# EAGLE schematic MAAV_Vehicle_13v1 (EAGLE 5.11)
DIGIKEY: SI4114DY-T1-GE3CT-ND; DIGIKEY_ASSOC: P5.1MGCT-ND

## Sheet 1 of 7
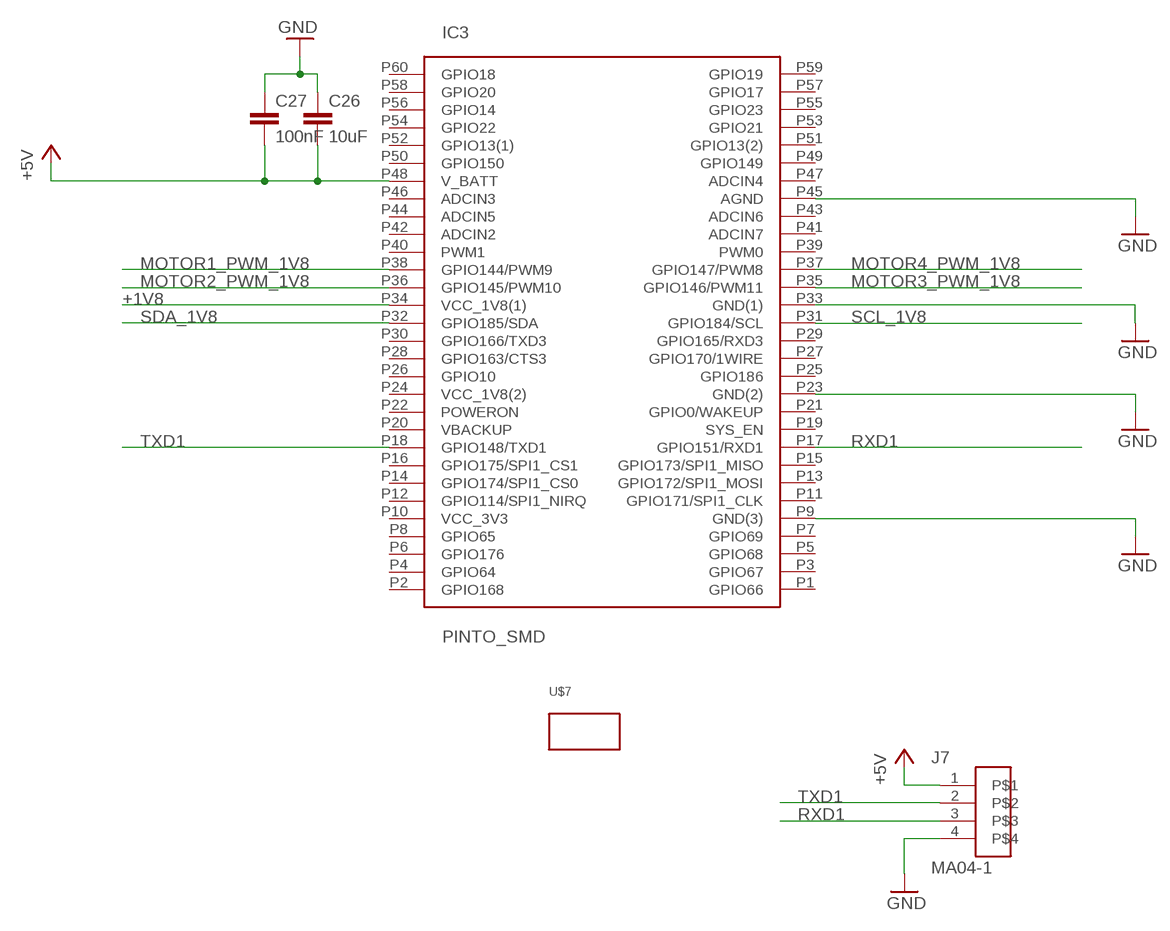
[diagram p0: schematic, sheet 1]

### Parts
C26  10uF  CAP0603-CAP  [0603-CAP]
C27  100nF  CAP0603-CAP  [0603-CAP]
IC3  PINTO_SMD  [PINTO_SMD]
J7  MA04-1  [455-1751-1-ND]
U$7  IMU  [IMU]

### Nets
+1V8: IC3.P34(VCC_1V8(1)) ; also sheet 2
+5V: C26.2 C27.2 IC3.P48(V_BATT) J7.1 ; also sheet 2,3,4,6,7
GND: C26.1 C27.1 IC3.P9(GND(3)) IC3.P23(GND(2)) IC3.P33(GND(1)) IC3.P45(AGND) J7.4 ; also sheet 3,4,5,6,7
MOTOR1_PWM_1V8: IC3.P38(GPIO144/PWM9) ; also sheet 2
MOTOR2_PWM_1V8: IC3.P36(GPIO145/PWM10) ; also sheet 2
MOTOR3_PWM_1V8: IC3.P35(GPIO146/PWM11) ; also sheet 2
MOTOR4_PWM_1V8: IC3.P37(GPIO147/PWM8) ; also sheet 2
RXD1: IC3.P17(GPIO151/RXD1) J7.3
SCL_1V8: IC3.P31(GPIO184/SCL) ; also sheet 2
SDA_1V8: IC3.P32(GPIO185/SDA) ; also sheet 2
TXD1: IC3.P18(GPIO148/TXD1) J7.2
Unconnected: IC3.P1(GPIO66) IC3.P2(GPIO168) IC3.P3(GPIO67) IC3.P4(GPIO64) IC3.P5(GPIO68) IC3.P6(GPIO176) IC3.P7(GPIO69) IC3.P8(GPIO65) IC3.P10(VCC_3V3) IC3.P11(GPIO171/SPI1_CLK) IC3.P12(GPIO114/SPI1_NIRQ) IC3.P13(GPIO172/SPI1_MOSI) IC3.P14(GPIO174/SPI1_CS0) IC3.P15(GPIO173/SPI1_MISO) IC3.P16(GPIO175/SPI1_CS1) IC3.P19(SYS_EN) IC3.P20(VBACKUP) IC3.P21(GPIO0/WAKEUP) IC3.P22(POWERON) IC3.P24(VCC_1V8(2)) IC3.P25(GPIO186) IC3.P26(GPIO10) IC3.P27(GPIO170/1WIRE) IC3.P28(GPIO163/CTS3) IC3.P29(GPIO165/RXD3) IC3.P30(GPIO166/TXD3) IC3.P39(PWM0) IC3.P40(PWM1) IC3.P41(ADCIN7) IC3.P42(ADCIN2) IC3.P43(ADCIN6) IC3.P44(ADCIN5) IC3.P46(ADCIN3) IC3.P47(ADCIN4) IC3.P49(GPIO149) IC3.P50(GPIO150) IC3.P51(GPIO13(2)) IC3.P52(GPIO13(1)) IC3.P53(GPIO21) IC3.P54(GPIO22) IC3.P55(GPIO23) IC3.P56(GPIO14) IC3.P57(GPIO17) IC3.P58(GPIO20) IC3.P59(GPIO19) IC3.P60(GPIO18)

## Sheet 2 of 7
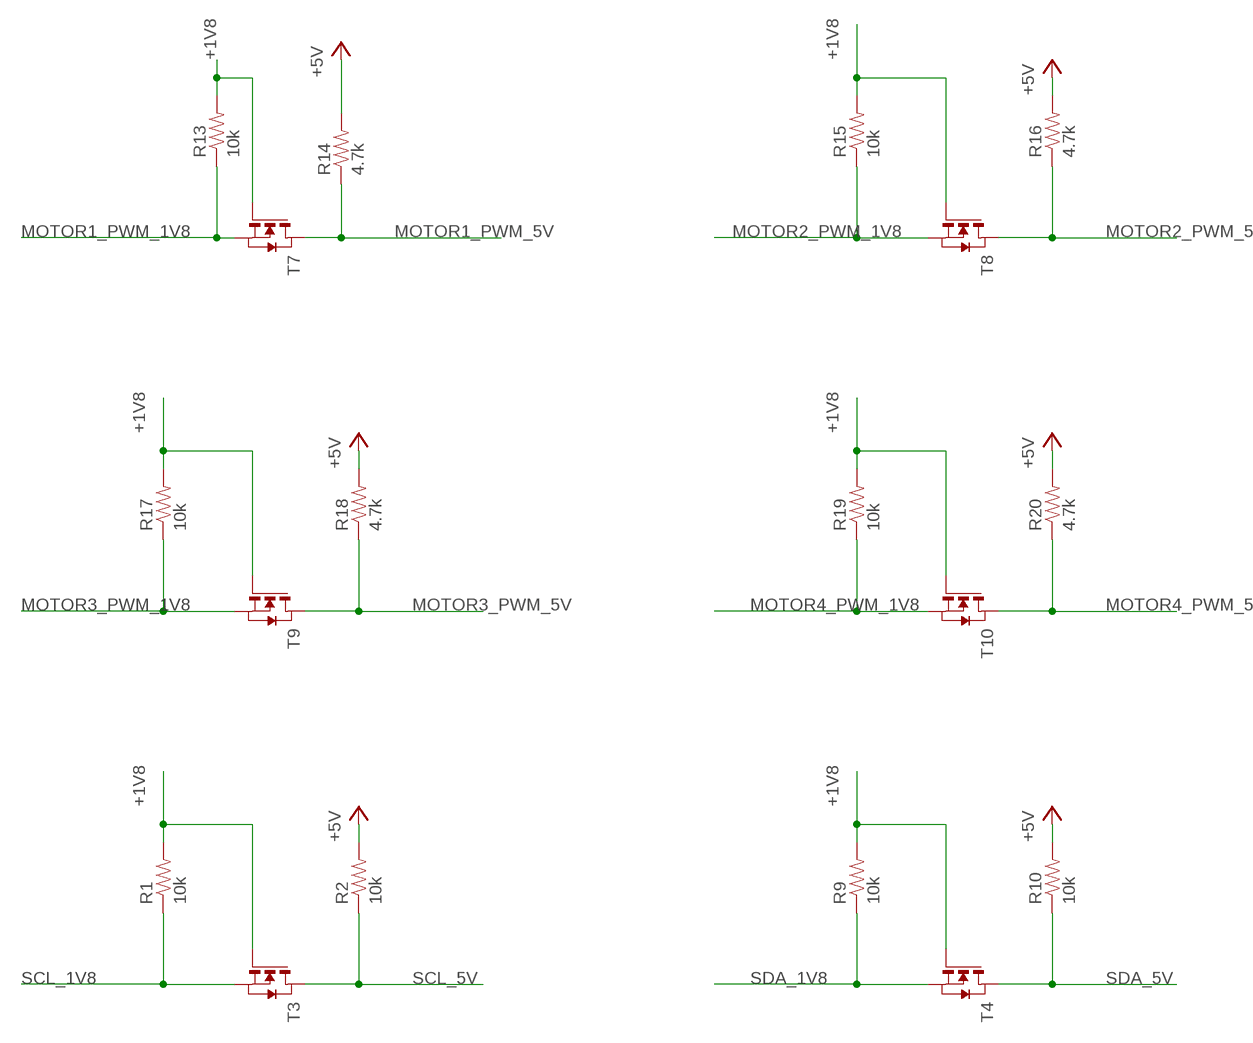
[diagram p1: schematic, sheet 2]

### Parts
R1  10k  RESISTOR0603-RES  [0603-RES]
R2  10k  RESISTOR0603-RES  [0603-RES]
R9  10k  RESISTOR0603-RES  [0603-RES]
R10  10k  RESISTOR0603-RES  [0603-RES]
R13  10k  RESISTOR0603-RES  [0603-RES]
R14  4.7k  RESISTOR0603-RES  [0603-RES]
R15  10k  RESISTOR0603-RES  [0603-RES]
R16  4.7k  RESISTOR0603-RES  [0603-RES]
R17  10k  RESISTOR0603-RES  [0603-RES]
R18  4.7k  RESISTOR0603-RES  [0603-RES]
R19  10k  RESISTOR0603-RES  [0603-RES]
R20  4.7k  RESISTOR0603-RES  [0603-RES]
T3  NMOSSOT23  [SOT-23]
T4  NMOSSOT23  [SOT-23]
T7  NMOSSOT23  [SOT-23]
T8  NMOSSOT23  [SOT-23]
T9  NMOSSOT23  [SOT-23]
T10  NMOSSOT23  [SOT-23]

### Nets
+1V8: R1.2 R9.2 R13.2 R15.2 R17.2 R19.2 T3.3(G) T4.3(G) T7.3(G) T8.3(G) T9.3(G) T10.3(G) ; also sheet 1
+5V: R2.2 R10.2 R14.2 R16.2 R18.2 R20.2 ; also sheet 1,3,4,6,7
MOTOR1_PWM_1V8: R13.1 T7.2(S) ; also sheet 1
MOTOR1_PWM_5V: R14.1 T7.1(D) ; also sheet 5
MOTOR2_PWM_1V8: R15.1 T8.2(S) ; also sheet 1
MOTOR2_PWM_5V: R16.1 T8.1(D) ; also sheet 5
MOTOR3_PWM_1V8: R17.1 T9.2(S) ; also sheet 1
MOTOR3_PWM_5V: R18.1 T9.1(D) ; also sheet 5
MOTOR4_PWM_1V8: R19.1 T10.2(S) ; also sheet 1
MOTOR4_PWM_5V: R20.1 T10.1(D) ; also sheet 5
SCL_1V8: R1.1 T3.2(S) ; also sheet 1
SCL_5V: R2.1 T3.1(D) ; also sheet 3
SDA_1V8: R9.1 T4.2(S) ; also sheet 1
SDA_5V: R10.1 T4.1(D) ; also sheet 3

## Sheet 3 of 7
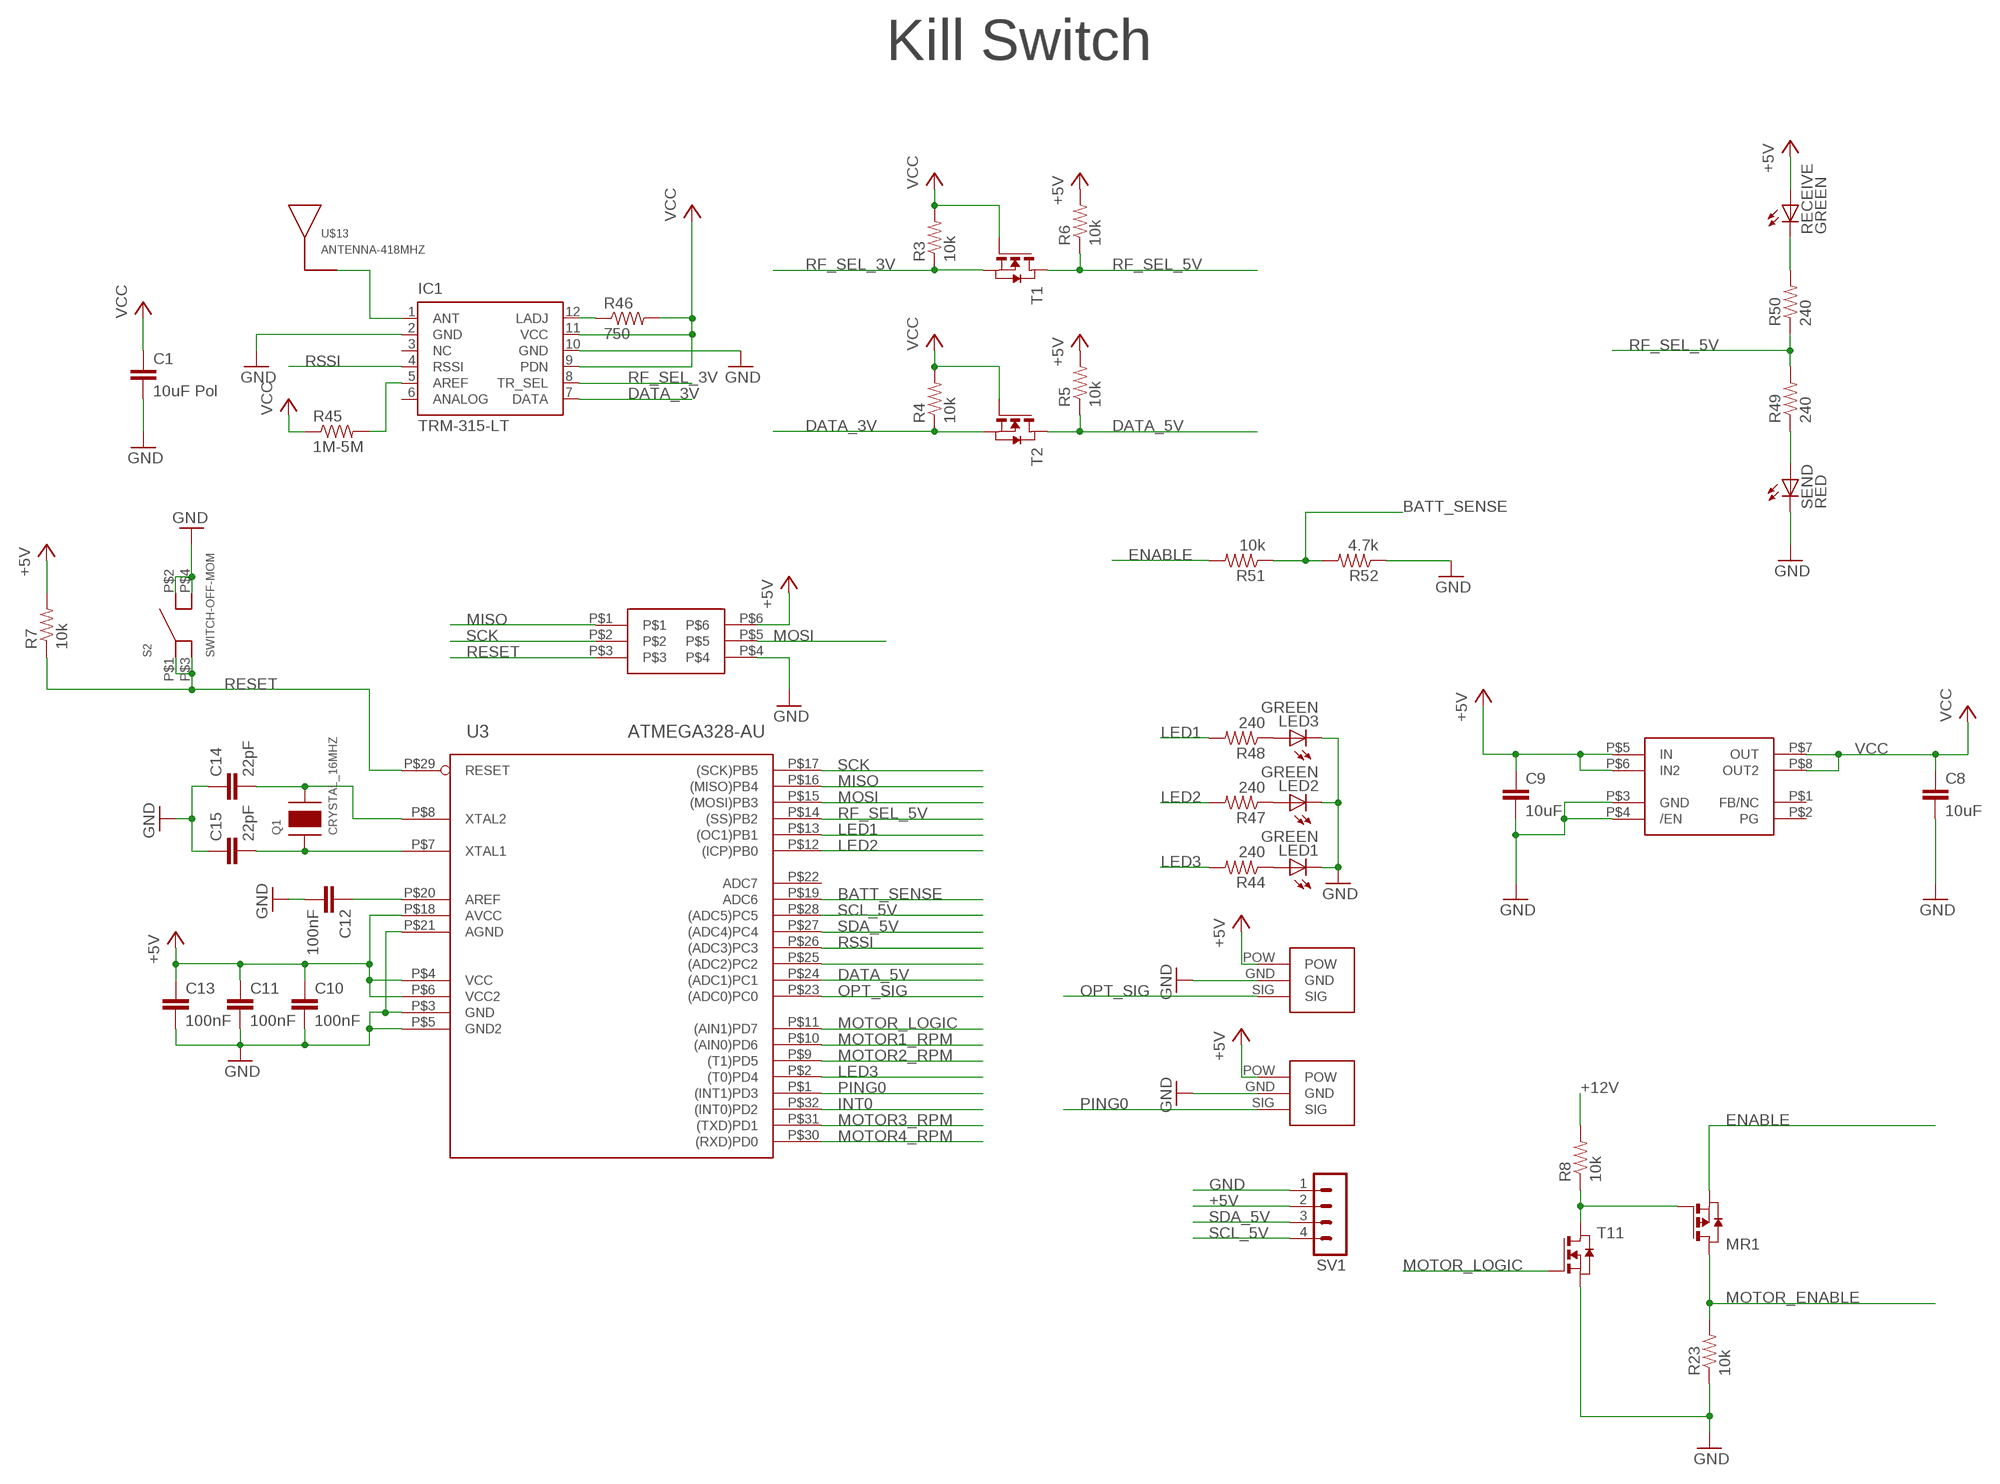
[diagram p2: schematic, sheet 3]

### Parts
C1  10uF Pol  CAP0805  [0805]
C8  10uF  CAP0805  [0805]
C9  10uF  CAP0603-CAP  [0603-CAP]
C10  100nF  CAP0603-CAP  [0603-CAP]
C11  100nF  CAP0603-CAP  [0603-CAP]
C12  100nF  CAP0603-CAP  [0603-CAP]
C13  100nF  CAP0603-CAP  [0603-CAP]
C14  22pF  CAP0603-CAP  [0603-CAP]
C15  22pF  CAP0603-CAP  [0603-CAP]
IC1  TRM-315-LT  [TRM-XXX-LT]
J1  MA03-2  [MA03-2]
LED1  GREEN  LED0603  [LED-0603]
LED2  GREEN  LED0603  [LED-0603]
LED3  GREEN  LED0603  [LED-0603]
MR1  PMOSSOT23  [SOT-23]
Q1  CRYSTAL_16MHZ  [CRYSTAL_16MHZ]
R3  10k  RESISTOR0603-RES  [0603-RES]
R4  10k  RESISTOR0603-RES  [0603-RES]
R5  10k  RESISTOR0603-RES  [0603-RES]
R6  10k  RESISTOR0603-RES  [0603-RES]
R7  10k  RESISTOR0603-RES  [0603-RES]
R8  10k  RESISTOR0805-RES  [0805]
R23  10k  RESISTOR0805-RES  [0805]
R44  240  RESISTOR0603-RES  [0603-RES]
R45  1M-5M  RESISTOR0603-RES  [0603-RES]
R46  750  RESISTOR0603-RES  [0603-RES]
R47  240  RESISTOR0603-RES  [0603-RES]
R48  240  RESISTOR0603-RES  [0603-RES]
R49  240  RESISTOR0603-RES  [0603-RES]
R50  240  RESISTOR0603-RES  [0603-RES]
R51  10k  RESISTOR0603-RES  [0603-RES]
R52  4.7k  RESISTOR0603-RES  [0603-RES]
RECEIVE  GREEN  LED0603  [LED-0603]
S2  SWITCH-OFF-MOM  [SWITCH-OFF-MOM]
SEND  RED  LED0603  [LED-0603]
SV1  MA04-1  [MA04-1]
T1  NMOSSOT23  [SOT-23]
T2  NMOSSOT23  [SOT-23]
T11  NMOSSOT23  [SOT-23]
U3  ATMEGA328-AU  [32-TQFP]
U4  REG_3V_8SOIC  [8-SOIC]
U$10  H3894-ND  [H3894-ND]
U$13  ANTENNA-418MHZ  [ANTENNA-418MHZ]
U$16  H3894-ND  [H3894-ND]

### Nets
+5V: C9.1 C10.1 C11.1 C13.1 J1.P$6 R5.2 R6.2 R7.2 RECEIVE.A SV1.2 U3.P$4(VCC) U3.P$6(VCC2) U3.P$18(AVCC) U4.P$5(IN) U4.P$6(IN2) U$10.POW U$16.POW ; also sheet 1,2,4,6,7
+12V: R8.2 ; also sheet 4,5,6
ANTENNA: IC1.1(ANT) U$13.P$1 ; also sheet 7
BATT_SENSE: R51.1 R52.2 U3.P$19(ADC6)
DATA_3V: IC1.7(DATA) R4.1 T2.2(S)
DATA_5V: R5.1 T2.1(D) U3.P$24((ADC1)PC1)
ENABLE: MR1.2(S) R51.2 ; also sheet 4
GND: C1.2 C8.2 C9.2 C10.2 C11.2 C12.2 C13.2 C14.1 C15.1 IC1.2(GND) IC1.10(GND) J1.P$4 LED1.C LED2.C LED3.C R23.1 R52.1 S2.P$2(P2) S2.P$4(P4) SEND.C SV1.1 T11.2(S) U3.P$3(GND) U3.P$5(GND2) U3.P$21(AGND) U4.P$3(GND) U4.P$4(/EN) U$10.GND U$16.GND ; also sheet 1,4,5,6,7
INT0: U3.P$32((INT0)PD2) ; also sheet 7
LED1: R48.2 U3.P$13((OC1)PB1)
LED2: R47.2 U3.P$12((ICP)PB0)
LED3: R44.2 U3.P$2((T0)PD4)
MISO: J1.P$1 U3.P$16((MISO)PB4) ; also sheet 7
MOSI: J1.P$5 U3.P$15((MOSI)PB3) ; also sheet 7
MOTOR1_RPM: U3.P$10((AIN0)PD6) ; also sheet 6
MOTOR2_RPM: U3.P$9((T1)PD5) ; also sheet 6
MOTOR3_RPM: U3.P$31((TXD)PD1) ; also sheet 6
MOTOR4_RPM: U3.P$30((RXD)PD0) ; also sheet 6
MOTOR_ENABLE: MR1.1(D) R23.2 ; also sheet 5
MOTOR_LOGIC: T11.3(G) U3.P$11((AIN1)PD7)
N$2: LED1.A R44.1
N$3: C12.1 U3.P$20(AREF)
N$5: MR1.3(G) R8.1 T11.1(D)
N$6: C14.2 Q1.P$2 U3.P$8(XTAL2)
N$8: C15.2 Q1.P$1 U3.P$7(XTAL1)
N$10: R50.2 RECEIVE.C
N$23: R49.1 SEND.A
N$24: U3.P$25((ADC2)PC2)
N$29: IC1.5(AREF) R45.2
N$30: IC1.12(LADJ) R46.1
N$33: LED2.A R47.1
N$34: LED3.A R48.1
OPT_SIG: U3.P$23((ADC0)PC0) U$16.SIG
PING0: U3.P$1((INT1)PD3) U$10.SIG
RESET: J1.P$3 R7.1 S2.P$1(P1) S2.P$3(P3) U3.P$29(RESET)
RF_SEL_3V: IC1.8(TR_SEL) R3.1 T1.2(S)
RF_SEL_5V: R6.1 R49.2 R50.1 T1.1(D) U3.P$14((SS)PB2) ; also sheet 7
RSSI: IC1.4(RSSI) U3.P$26((ADC3)PC3)
SCK: J1.P$2 U3.P$17((SCK)PB5) ; also sheet 7
SCL_5V: SV1.4 U3.P$28((ADC5)PC5) ; also sheet 2
SDA_5V: SV1.3 U3.P$27((ADC4)PC4) ; also sheet 2
VCC: C1.1 C8.1 IC1.9(PDN) IC1.11(VCC) R3.2 R4.2 R45.1 R46.2 T1.3(G) T2.3(G) U4.P$7(OUT) U4.P$8(OUT2)
Unconnected: IC1.3(NC) IC1.6(ANALOG) U3.P$22(ADC7) U4.P$1(FB/NC) U4.P$2(PG)

### Notes on the sheet
- Kill Switch

## Sheet 4 of 7
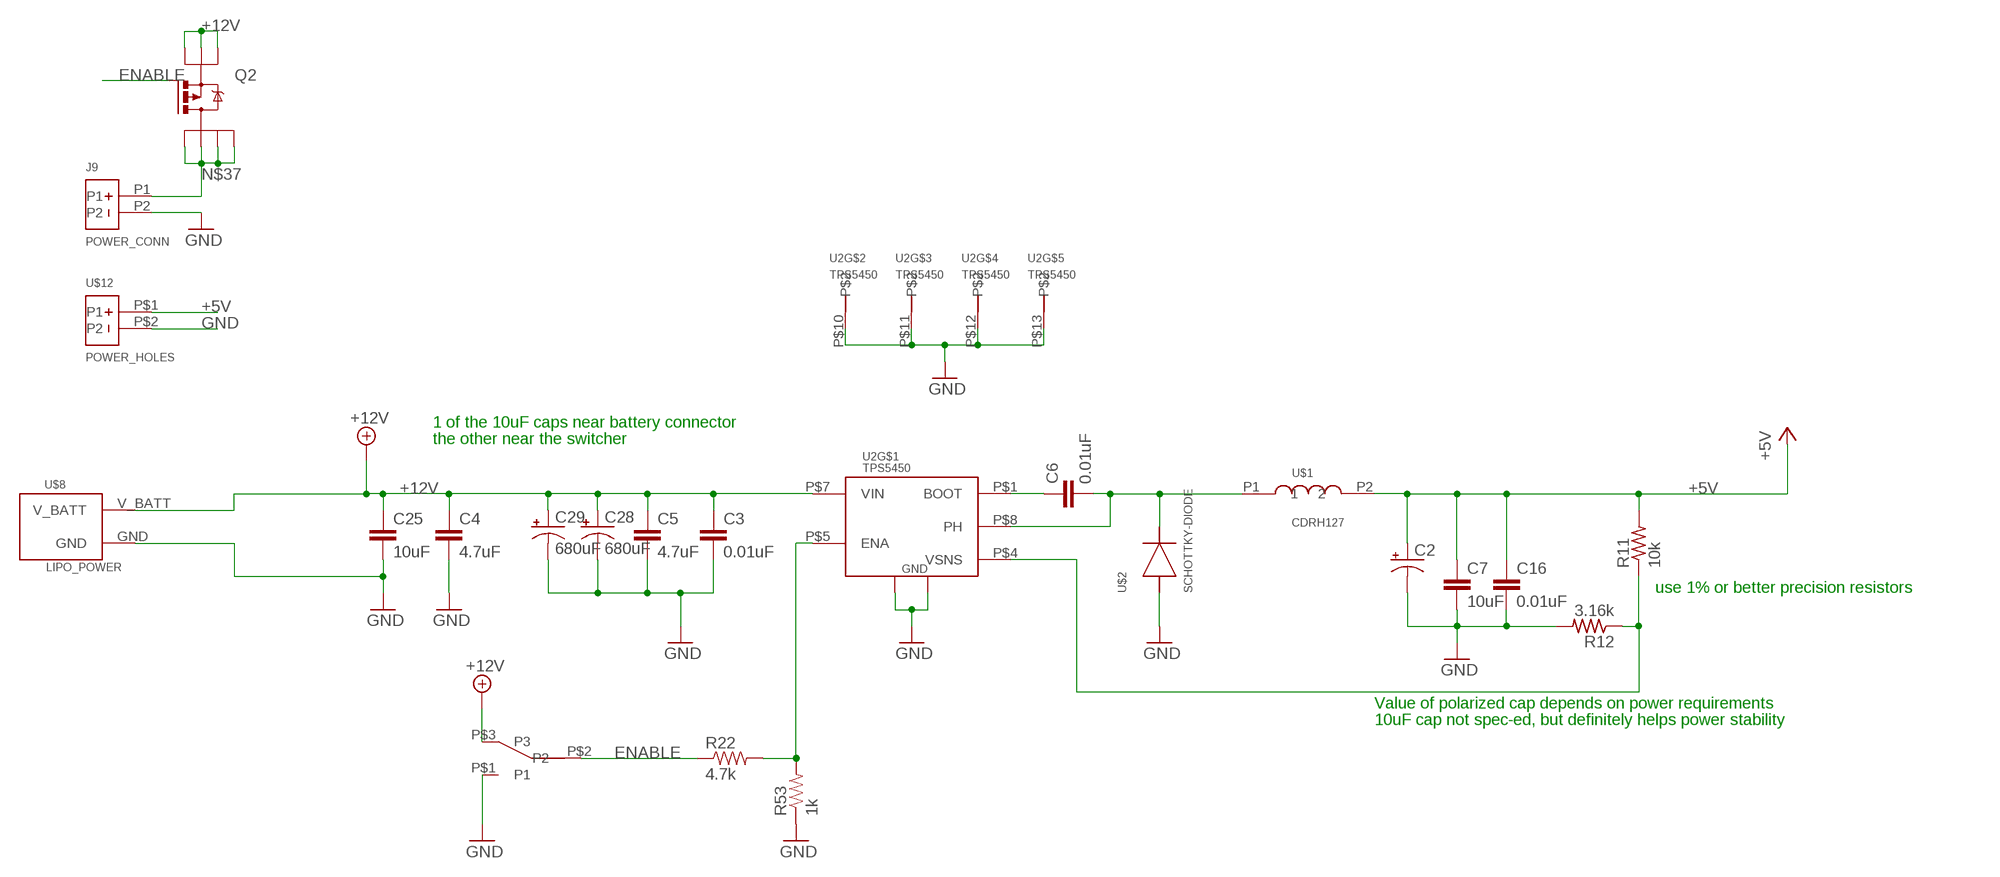
[diagram p3: schematic, sheet 4]

### Parts
C2  CAP_POL  [2917]
C3  0.01uF  C-EUC1210  [C1210]
C4  4.7uF  C-EUC1210  [C1210]
C5  4.7uF  C-EUC1210  [C1210]
C6  0.01uF  C-EUC1210  [C1210]
C7  10uF  C-EUC1210  [C1210]
C16  0.01uF  C-EUC1210  [C1210]
C25  10uF  C-EUC1210  [C1210]
C28  680uF  CPOL-USE22-9AXIAL  [EH22-9]
C29  680uF  CPOL-USE22-9AXIAL  [EH22-9]
J9  POWER_CONN  [POWER_CONN]
Q2  P-MOSFET-SO8  [SO-08]
R11  10k  R-US_R0603  [R0603]
R12  3.16k  R-US_R0603  [R0603]
R22  4.7k  RESISTOR0805-RES  [0805]
R53  1k  RESISTOR0805-RES  [0805]
S1  SWITCH-ON-ON  [SWITCH-ON-ON]
U2  TPS5450  [TPS5450]
U$1  CDRH127  [CDRH127]
U$2  SCHOTTKY-DIODE  [DO-214AB,SMC]
U$8  LIPO_POWER  [LIPO_POWER]
U$12  POWER_HOLES  [POWER_HOLES]

### Nets
+5V: C2.2(+) C7.1 C16.1 R11.2 U$1.P2 U$12.P$1(P1) ; also sheet 1,2,3,6,7
+12V: C3.1 C4.1 C5.1 C25.1 C28.+ C29.+ Q2.1(S) Q2.2(S) Q2.3(S) S1.P$3(P3) U2.P$7(VIN) U$8.V_BATT ; also sheet 3,5,6
ENABLE: Q2.4(G) R22.1 S1.P$2(P2) ; also sheet 3
GND: C2.1(-) C3.2 C4.2 C5.2 C7.2 C16.2 C25.2 C28.- C29.- J9.P2 R12.2 R53.1 S1.P$1(P1) U2.P$6(GND) U2.P$9(PGND) U2.P$10 U2.P$11 U2.P$12 U2.P$13 U$2.P$1 U$8.GND U$12.P$2(P2) ; also sheet 1,3,5,6,7
N$4: R11.1 R12.1 U2.P$4(VSNS)
N$9: C6.1 U2.P$1(BOOT)
N$11: R22.2 R53.2 U2.P$5(ENA)
N$28: C6.2 U2.P$8(PH) U$1.P1 U$2.P$2
N$37: J9.P1 Q2.5(D) Q2.6(D) Q2.7(D) Q2.8(D)

### Notes on the sheet
- 1 of the 10uF caps near battery connector
- the other near the switcher
- use 1% or better precision resistors
- Value of polarized cap depends on power requirements
- 10uF cap not spec-ed, but definitely helps power stability

## Sheet 5 of 7
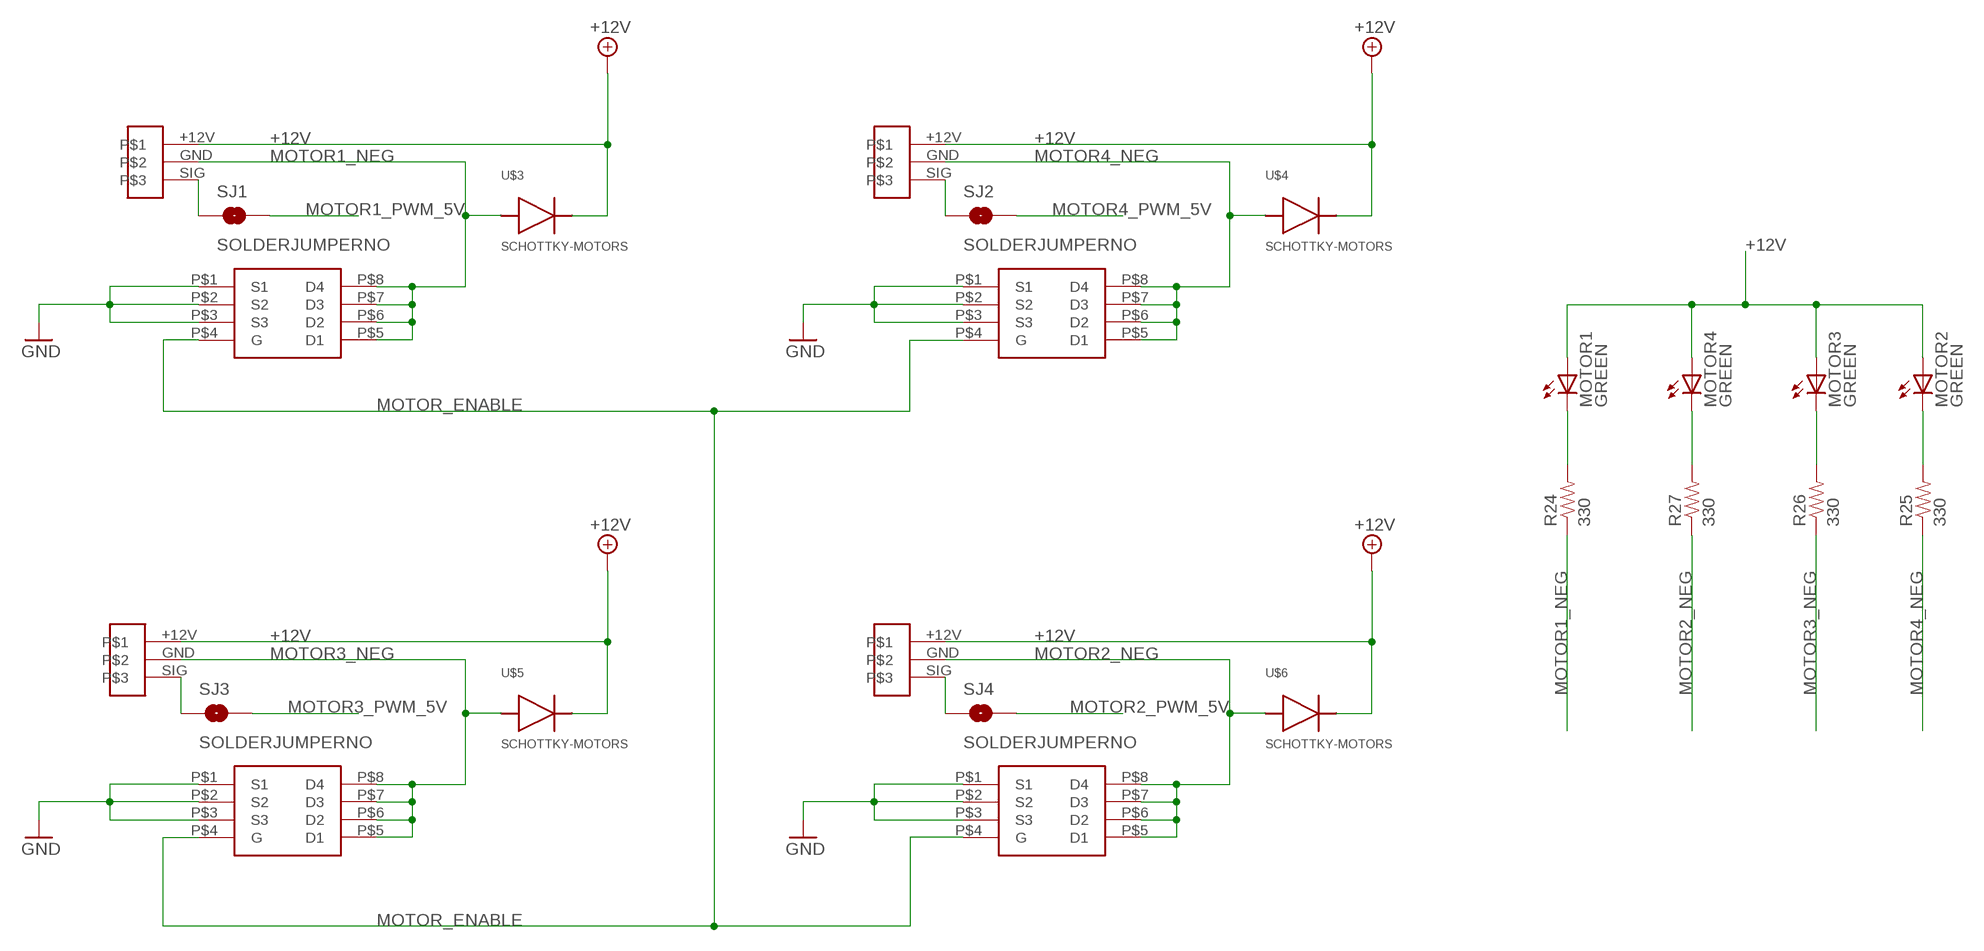
[diagram p4: schematic, sheet 5]

### Parts
J2  MOTOR_CONNTRU_HOLE  [MOTOR_CONN_THRU]
J3  MOTOR_CONNTRU_HOLE  [MOTOR_CONN_THRU]
J4  MOTOR_CONNTRU_HOLE  [MOTOR_CONN_THRU]
J5  MOTOR_CONNTRU_HOLE  [MOTOR_CONN_THRU]
MOTOR1  GREEN  LEDCHIPLED_0805  [CHIPLED_0805]
MOTOR2  GREEN  LEDCHIPLED_0805  [CHIPLED_0805]
MOTOR3  GREEN  LEDCHIPLED_0805  [CHIPLED_0805]
MOTOR4  GREEN  LEDCHIPLED_0805  [CHIPLED_0805]
R24  330  RESISTOR0805-RES  [0805]
R25  330  RESISTOR0805-RES  [0805]
R26  330  RESISTOR0805-RES  [0805]
R27  330  RESISTOR0805-RES  [0805]
SJ1  SOLDERJUMPERNO  [SJ_2S-NO]
SJ2  SOLDERJUMPERNO  [SJ_2S-NO]
SJ3  SOLDERJUMPERNO  [SJ_2S-NO]
SJ4  SOLDERJUMPERNO  [SJ_2S-NO]
T5  MOTOR_NFET  [8-SOIC]
T6  MOTOR_NFET  [8-SOIC]
T12  MOTOR_NFET  [8-SOIC]
T13  MOTOR_NFET  [8-SOIC]
U$3  SCHOTTKY-MOTORS  [DO-214AC,SMA]
U$4  SCHOTTKY-MOTORS  [DO-214AC,SMA]
U$5  SCHOTTKY-MOTORS  [DO-214AC,SMA]
U$6  SCHOTTKY-MOTORS  [DO-214AC,SMA]

### Nets
+12V: J2.+12V J3.+12V J4.+12V J5.+12V MOTOR1.A MOTOR2.A MOTOR3.A MOTOR4.A U$3.P$2 U$4.P$2 U$5.P$2 U$6.P$2 ; also sheet 3,4,6
GND: T5.P$1(S1) T5.P$2(S2) T5.P$3(S3) T6.P$1(S1) T6.P$2(S2) T6.P$3(S3) T12.P$1(S1) T12.P$2(S2) T12.P$3(S3) T13.P$1(S1) T13.P$2(S2) T13.P$3(S3) ; also sheet 1,3,4,6,7
MOTOR1_NEG: J2.GND R24.1 T5.P$5(D1) T5.P$6(D2) T5.P$7(D3) T5.P$8(D4) U$3.P$1
MOTOR1_PWM_5V: SJ1.2 ; also sheet 2
MOTOR2_NEG: J5.GND R27.1 T13.P$5(D1) T13.P$6(D2) T13.P$7(D3) T13.P$8(D4) U$6.P$1
MOTOR2_PWM_5V: SJ4.2 ; also sheet 2
MOTOR3_NEG: J3.GND R26.1 T12.P$5(D1) T12.P$6(D2) T12.P$7(D3) T12.P$8(D4) U$5.P$1
MOTOR3_PWM_5V: SJ3.2 ; also sheet 2
MOTOR4_NEG: J4.GND R25.1 T6.P$5(D1) T6.P$6(D2) T6.P$7(D3) T6.P$8(D4) U$4.P$1
MOTOR4_PWM_5V: SJ2.2 ; also sheet 2
MOTOR_ENABLE: T5.P$4(G) T6.P$4(G) T12.P$4(G) T13.P$4(G) ; also sheet 3
N$12: MOTOR1.C R24.2
N$13: MOTOR2.C R25.2
N$14: MOTOR3.C R26.2
N$15: MOTOR4.C R27.2
N$25: J2.SIG SJ1.1
N$31: J5.SIG SJ4.1
N$32: J4.SIG SJ2.1
N$35: J3.SIG SJ3.1

## Sheet 6 of 7
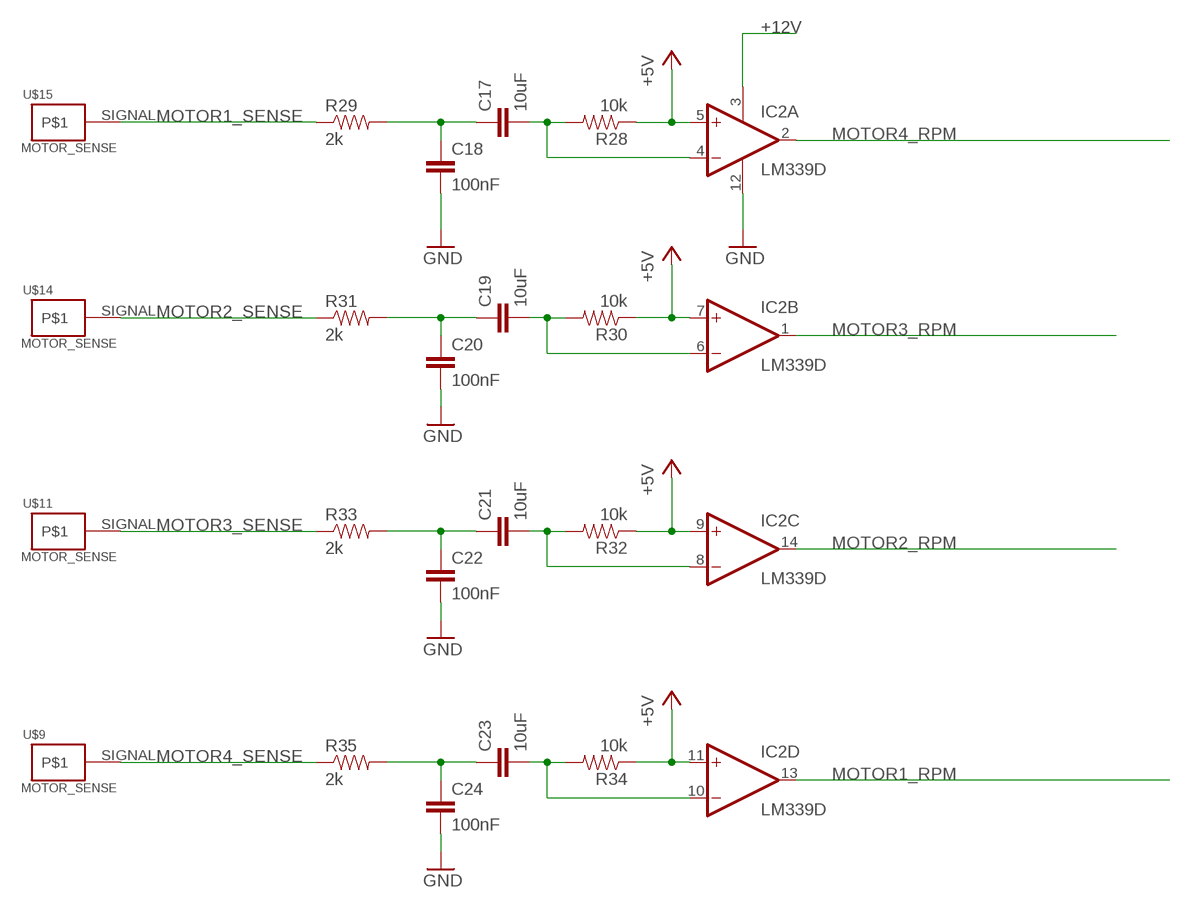
[diagram p5: schematic, sheet 6]

### Parts
C17  10uF  CAP0603-CAP  [0603-CAP]
C18  100nF  CAP0603-CAP  [0603-CAP]
C19  10uF  CAP0603-CAP  [0603-CAP]
C20  100nF  CAP0603-CAP  [0603-CAP]
C21  10uF  CAP0603-CAP  [0603-CAP]
C22  100nF  CAP0603-CAP  [0603-CAP]
C23  10uF  CAP0603-CAP  [0603-CAP]
C24  100nF  CAP0603-CAP  [0603-CAP]
IC2  LM339D  [SO14]
R28  10k  RESISTOR0603-RES  [0603-RES]
R29  2k  RESISTOR0603-RES  [0603-RES]
R30  10k  RESISTOR0603-RES  [0603-RES]
R31  2k  RESISTOR0603-RES  [0603-RES]
R32  10k  RESISTOR0603-RES  [0603-RES]
R33  2k  RESISTOR0603-RES  [0603-RES]
R34  10k  RESISTOR0603-RES  [0603-RES]
R35  2k  RESISTOR0603-RES  [0603-RES]
U$9  MOTOR_SENSE  [MOTOR_SENSE]
U$11  MOTOR_SENSE  [MOTOR_SENSE]
U$14  MOTOR_SENSE  [MOTOR_SENSE]
U$15  MOTOR_SENSE  [MOTOR_SENSE]

### Nets
+5V: IC2.5(A:+IN) IC2.7(B:+IN) IC2.9(C:+IN) IC2.11(D:+IN) R28.1 R30.1 R32.1 R34.1 ; also sheet 1,2,3,4,7
+12V: IC2.3(P:V+) ; also sheet 3,4,5
GND: C18.2 C20.2 C22.2 C24.2 IC2.12(P:GND) ; also sheet 1,3,4,5,7
MOTOR1_RPM: IC2.13(D:OUT) ; also sheet 3
MOTOR1_SENSE: R29.1 U$15.SIGNAL
MOTOR2_RPM: IC2.14(C:OUT) ; also sheet 3
MOTOR2_SENSE: R31.1 U$14.SIGNAL
MOTOR3_RPM: IC2.1(B:OUT) ; also sheet 3
MOTOR3_SENSE: R33.1 U$11.SIGNAL
MOTOR4_RPM: IC2.2(A:OUT) ; also sheet 3
MOTOR4_SENSE: R35.1 U$9.SIGNAL
N$7: C19.1 C20.1 R31.2
N$16: C17.2 IC2.4(A:-IN) R28.2
N$17: C17.1 C18.1 R29.2
N$18: C19.2 IC2.6(B:-IN) R30.2
N$19: C21.1 C22.1 R33.2
N$20: C21.2 IC2.8(C:-IN) R32.2
N$21: C23.1 C24.1 R35.2
N$22: C23.2 IC2.10(D:-IN) R34.2

## Sheet 7 of 7
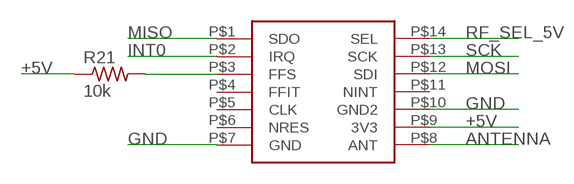
[diagram p6: schematic, sheet 7]

### Parts
R21  10k  R-US_R0603  [R0603]
U$17  RF12  [RF12]

### Nets
+5V: R21.1 U$17.P$9(3V3) ; also sheet 1,2,3,4,6
ANTENNA: U$17.P$8(ANT) ; also sheet 3
GND: U$17.P$7(GND) U$17.P$10(GND2) ; also sheet 1,3,4,5,6
INT0: U$17.P$2(IRQ) ; also sheet 3
MISO: U$17.P$1(SDO) ; also sheet 3
MOSI: U$17.P$12(SDI) ; also sheet 3
N$26: R21.2 U$17.P$3(FFS)
RF_SEL_5V: U$17.P$14(SEL) ; also sheet 3
SCK: U$17.P$13(SCK) ; also sheet 3
Unconnected: U$17.P$4(FFIT) U$17.P$5(CLK) U$17.P$6(NRES) U$17.P$11(NINT)

## Library data of the parts
C1 C8-C15 C17-C24 C26 C27 = SparkFun:CAP: Capacitor Standard 0603 ceramic capacitor, and 0.1" leaded capacitor.
C2 = SparkFun:CAP_POL: Capacitor Polarized These are standard SMD and PTH capacitors. Normally 10uF, 47uF, and 100uF in electrolytic and tantalum varieties. Always verify the external diameter of the through hole cap, it varies with capacity, voltage, and manufacturer. The EIA devices should be standard.
C3-C7 C16 C25 = resistor:C-EU: CAPACITOR, European symbol
C28 C29 = MAAV:CPOL-US: POLARIZED CAPACITOR, American symbol
IC1 = linx:TRM-*-LT: LT SERIES TRANSCEIVER MODULE bidirectional wireless transfer serial data Source: www.linxtechnologies.com .. TRM-xxx-LT_Data_Guide.pdf; OC_FARNELL: unknown; OC_NEWARK: unknown
IC2 = linear:LM339: Low Power Low Offset Voltage Quad Comparators with open collector; LM139/LM239/LM339/LM2901/LM3302
IC3 = MAAV:PINTO_SMD
J1 = MAAV:MA03-2
J2-J5 = MAAV:MOTOR_CONN
J7 = MAAV:MA04-1
J9 = MAAV:POWER_CONN; DIGIKEY: A30614-ND
LED1-LED3 RECEIVE SEND = SparkFun:LED: LEDs Standard schematic elements and footprints for 5mm, 3mm, 1206, and 0603 sized LEDs. 5mm - Spark Fun Electronics SKU : COM-00529 (and others)
MOTOR1-MOTOR4 = led:LED: LED OSRAM: - CHIPLED LG R971, LG N971, LY N971, LG Q971, LY Q971, LO R971, LY R971 LH N974, LH R974 LS Q976, LO Q976, LY Q976 LO Q996 - Hyper CHIPLED LW Q18S LB Q993, LB Q99A, LB R99A - SideLED LS A670, LO A670, LY A670, LG A670, LP A670 LB A673, LV A673, LT A673, LW A673 LH A674 LY A675 LS A676, LA A676, LO A676, LY A676, LW A676 LS A679, LY A679, LG A679 - Hyper Micro SIDELED® LS Y876, LA Y876, LO Y876, LY Y876 LT Y87S - SmartLED LW L88C, LW L88S LB L89C, LB L89S, LG L890 LS L89K, LO L89K, LY L89K LS L896, LA L896, LO L896, LY L896 - TOPLED LS T670, LO T670, LY T670, LG T670, LP T670 LSG T670, LSP T670, LSY T670, LOP T670, LYG T670 LG T671, LOG T671, LSG T671 LB T673, LV T673, LT T673, LW T673 LH T674 LS T676, LA T676, LO T676, LY T676, LB T676, LH T676, LSB T676, LW T676 LB T67C, LV T67C, LT T67C, LS T67K, LO T67K, LY T67K, LW E67C LS E67B, LA E67B, LO E67B, LY E67B, LB E67C, LV E67C, LT E67C LW T67C LS T679, LY T679, LG T679 LS T770, LO T770, LY T770, LG T770, LP T770 LB T773, LV T773, LT T773, LW T773 LH T774 LS E675, LA E675, LY E675, LS T675 LS T776, LA T776, LO T776, LY T776, LB T776 LHGB T686 LT T68C, LB T68C - Hyper Mini TOPLED® LB M676 - Mini TOPLED Santana® LG M470 LS M47K, LO M47K, LY M47K Source: http://www.osram.convergy.de LUXEON: - LUMILED® LXK2-PW12-R00, LXK2-PW12-S00, LXK2-PW14-U00, LXK2-PW14-V00 LXK2-PM12-R00, LXK2-PM12-S00, LXK2-PM14-U00 LXK2-PE12-Q00, LXK2-PE12-R00, LXK2-PE12-S00, LXK2-PE14-T00, LXK2-PE14-U00 LXK2-PB12-K00, LXK2-PB12-L00, LXK2-PB12-M00, LXK2-PB14-N00, LXK2-PB14-P00, LXK2-PB14-Q00 LXK2-PR12-L00, LXK2-PR12-M00, LXK2-PR14-Q00, LXK2-PR14-R00 LXK2-PD12-Q00, LXK2-PD12-R00, LXK2-PD12-S00 LXK2-PH12-R00, LXK2-PH12-S00 LXK2-PL12-P00, LXK2-PL12-Q00, LXK2-PL12-R00 Source: www.luxeon.com KINGBRIGHT: KA-3528ASYC Source: www.kingbright.com
MR1 = zetex:PMOSSOT23: MOS FET; OC_FARNELL: unknown; OC_NEWARK: unknown
Q1 = MAAV:CRYSTAL_16MHZ; DIGIKEY: 300-8499-ND
Q2 = MAAV:P-MOSFET-SO8: P-Channel MOSFET Example: FDS4435A; P-Channel Logic Level PowerTrench® MOSFET FDS4465; P-Channel 1.8V Specified PowerTrench® MOSFET Source: www.fairchildsemi.com
R1-R10 R13-R20 R22-R35 R44-R53 = SparkFun:RESISTOR: Resistor Basic schematic elements and footprints for 0603, 1206, and PTH resistors.
R11 R12 = resistor:R-US_: RESISTOR, American symbol
R21 = rcl:R-US_: RESISTOR, American symbol
S1 = MAAV:SWITCH-ON-ON; DIGIKEY: EG1917-ND
S2 = p498:SWITCH-OFF-MOM; DIGIKEY: P11084SCT-ND
SJ1-SJ4 = SparkFun:SOLDERJUMPER: Solder Jumper Standard SMD solder jumper. Used to automate production. Two varients : Normally Open and Normally Closed are the same, but have different paste layers. NC will have a large amount of paste and should jumper during reflow.
SV1 = con-lstb:MA04-1: PIN HEADER; OC_FARNELL: unknown; OC_NEWARK: unknown
T1-T4 T7-T11 = zetex:NMOSSOT23: MOS FET; OC_FARNELL: unknown; OC_NEWARK: unknown
T5 T6 T12 T13 = MAAV:MOTOR_NFET; DIGIKEY: SI4114DY-T1-GE3CT-ND
U2 = MAAV:TPS5450; DIGIKEY: 296-23750-1-ND
U3 = MAAV:ATMEGA328-AU; DIGIKEY: ATMEGA328-AU-ND
U4 = MAAV:REG_3V_8SOIC; DIGIKEY: 296-2719-5-ND
U$1 = MAAV:CDRH127; DIGIKEY: 308-1333-1-ND
U$2 = MAAV:SCHOTTKY-DIODE: Digi-Key Part Number: B540C-FDICT-ND Category: Discrete Semiconductor Products Family: Diodes, Rectifiers - Single Diode Type: Schottky Voltage - DC Reverse (Vr) (Max): 40V Current - Average Rectified (Io): 5A Voltage - Forward (Vf) (Max) @ If: 550mV @ 5A Speed Fast Recovery: =< 500ns, > 200mA (Io) Current - Reverse Leakage @ Vr: 500µA @ 40V Capacitance @ Vr, F: 300pF @ 4V, 1MHz Mounting Type: Surface Mount Package / Case: DO-214AB, SMC Supplier Device Package: SMC
U$3-U$6 = MAAV:SCHOTTKY-MOTORS; DIGIKEY: RSX501L-20TE25CT-ND
U$7 = MAAV:IMU
U$8 = MAAV:LIPO_POWER
U$9 U$11 U$14 U$15 = MAAV:MOTOR_SENSE
U$10 U$16 = MAAV:H3894-ND; DIGIKEY: H3894-ND
U$12 = MAAV:POWER_HOLES
U$13 = MAAV:ANTENNA-418MHZ; DIGIKEY: ANT-418-PW-LP-ND
U$17 = MAAV:RF12